# EAGLE design Dancarino (EAGLE 7.2.0)
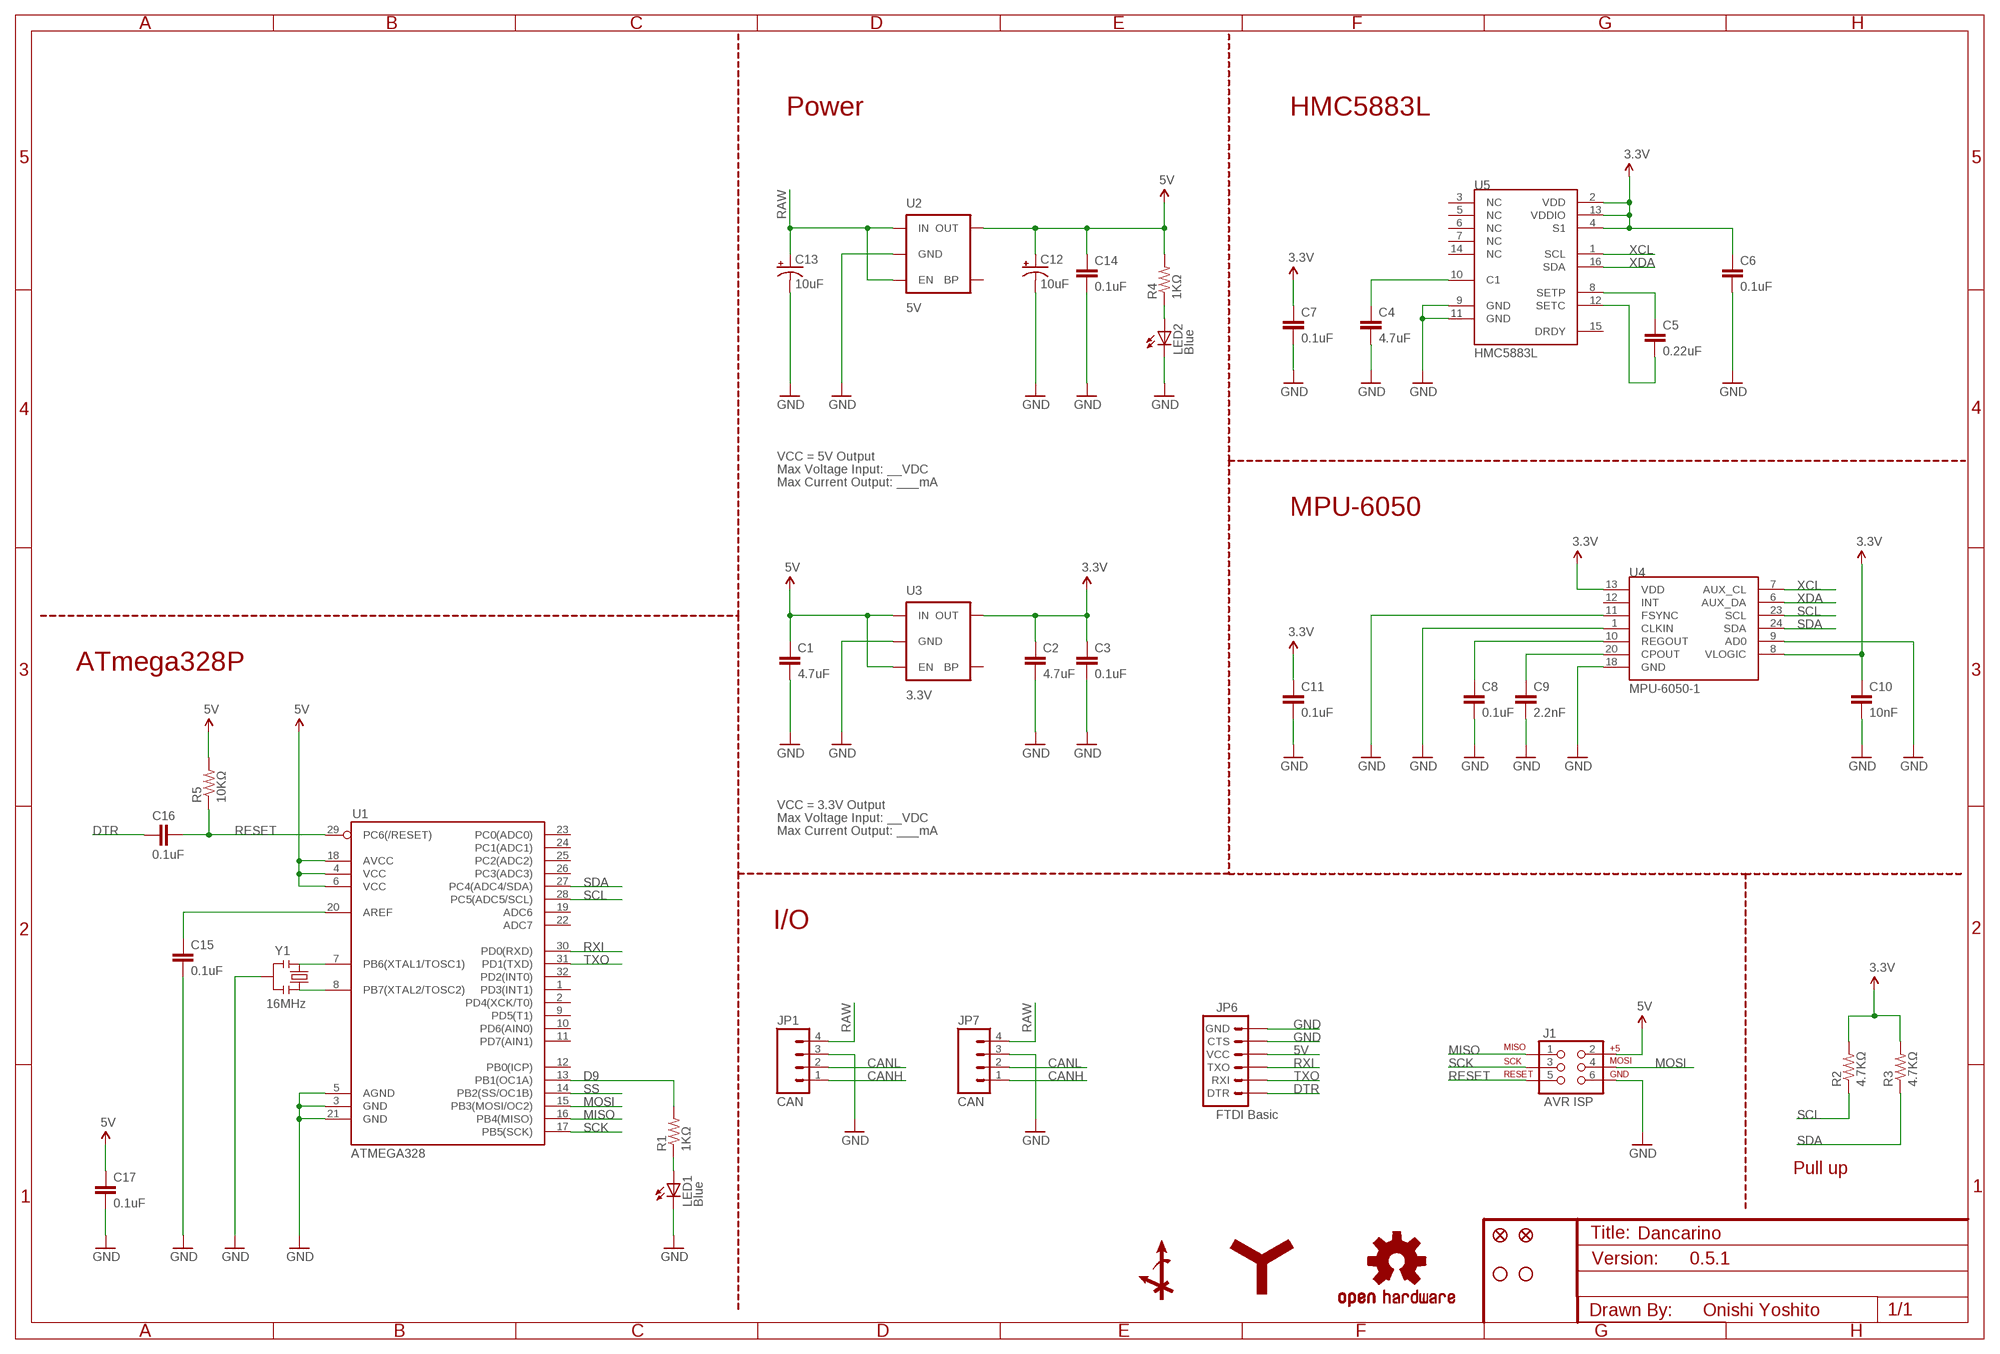
[diagram p0: schematic, sheet 1]

## Parts
C1  4.7uF  CAP0402-CAP  [0402-CAP]
C2  4.7uF  CAP0402-CAP  [0402-CAP]
C3  0.1uF  CAP0402-CAP  [0402-CAP]
C4  4.7uF  CAP0402-CAP  [0402-CAP]
C5  0.22uF  CAP0402-CAP  [0402-CAP]
C6  0.1uF  CAP0402-CAP  [0402-CAP]
C7  0.1uF  CAP0402-CAP  [0402-CAP]
C8  0.1uF  CAP0402-CAP  [0402-CAP]
C9  2.2nF  CAP0402-CAP  [0402-CAP]
C10  10nF  CAP0402-CAP  [0402-CAP]
C11  0.1uF  CAP0402-CAP  [0402-CAP]
C12  10uF  CAP_POL1206  [EIA3216]
C13  10uF  CAP_POL1206  [EIA3216]
C14  0.1uF  CAP0402-CAP  [0402-CAP]
C15  0.1uF  CAP0402-CAP  [0402-CAP]
C16  0.1uF  CAP0402-CAP  [0402-CAP]
C17  0.1uF  CAP0402-CAP  [0402-CAP]
J1  AVR ISP  AVR_SPI_PRG_6NS  [2X3-NS]
JP1  CAN  M04JST-PTH  [JST-4-PTH]
JP2  FIDUCIALUFIDUCIAL  [MICRO-FIDUCIAL]
JP3  STAND-OFFTIGHT  [STAND-OFF-TIGHT]
JP4  STAND-OFFTIGHT  [STAND-OFF-TIGHT]
JP5  FIDUCIALUFIDUCIAL  [MICRO-FIDUCIAL]
JP6  FTDI Basic  ARDUINO_SERIAL_PROGRAMPTH  [1X06]
JP7  CAN  M04JST-PTH  [JST-4-PTH]
LED1  Blue  LED0603  [LED-0603]
LED2  Blue  LED0603  [LED-0603]
R1  1KΩ  RESISTOR0402-RES  [0402-RES]
R2  4.7KΩ  RESISTOR0402-RES  [0402-RES]
R3  4.7KΩ  RESISTOR0402-RES  [0402-RES]
R4  1KΩ  RESISTOR0402-RES  [0402-RES]
R5  10KΩ  RESISTOR0402-RES  [0402-RES]
U1  ATMEGA328  ATMEGA168  [TQFP32-08]
U2  5V  V_REG_LDOSMD  [SOT23-5]
U3  3.3V  V_REG_LDOSMD  [SOT23-5]
U4  MPU-6050-1  [QFN-24-4MM2]
U5  HMC5883L  HMC5883LSMD  [16LPCC]
U$2  OSHW-LOGOS  [OSHW-LOGO-S]
U$11  AXIS-ANGLE_S  [AXIS-ANGLE_S]
U$13  YCAM_LOGO_L  [YCAM_LOGO_L]
Y1  16MHz  RESONATORSMD  [RESONATOR-SMD]

## Nets
3.3V [5V]: C2.1 C3.1 C6.1 C7.1 C10.1 C11.1 R2.2 R3.2 U3.5(OUT) U4.8(VLOGIC) U4.13(VDD) U5.2(VDD) U5.4(S1) U5.13(VDDIO)
5V [5V]: C1.1 C12.A(+) C14.1 C17.1 J1.2 JP6.4(VCC) R4.2 R5.2 U1.4(VCC) U1.6(VCC) U1.18(AVCC) U2.5(OUT) U3.1(IN) U3.3(EN)
CANH: JP1.1 JP7.1
CANL: JP1.2 JP7.2
D9: R1.2 U1.13(PB1(OC1A))
DTR: C16.1 JP6.1(DTR)
GND [GND]: C1.2 C2.2 C3.2 C4.2 C6.2 C7.2 C8.2 C9.2 C10.2 C11.2 C12.C(-) C13.C(-) C14.2 C15.2 C17.2 J1.6 JP1.3 JP6.5(CTS) JP6.6(GND) JP7.3 LED1.C LED2.C U1.3(GND) U1.5(AGND) U1.21(GND) U2.2(GND) U3.2(GND) U4.1(CLKIN) U4.9(AD0) U4.11(FSYNC) U4.18(GND) U5.9(GND) U5.11(GND) Y1.2
MISO: J1.1 U1.16(PB4(MISO))
MOSI: J1.4 U1.15(PB3(MOSI/OC2))
N$1: LED1.A R1.1
N$2: LED2.A R4.1
N$3: C4.1 U5.10(C1)
N$4: C5.1 U5.8(SETP)
N$5: C5.2 U5.12(SETC)
N$6: C9.1 U4.20(CPOUT)
N$7: C8.1 U4.10(REGOUT)
N$8: U1.7(PB6(XTAL1/TOSC1)) Y1.1
N$9: U1.8(PB7(XTAL2/TOSC2)) Y1.3
N$10: C15.1 U1.20(AREF)
RAW [RAW]: C13.A(+) JP1.4 JP7.4 U2.1(IN) U2.3(EN)
RESET: C16.2 J1.5 R5.1 U1.29(PC6(/RESET))
RXI: JP6.3(TXO) U1.30(PD0(RXD))
SCK: J1.3 U1.17(PB5(SCK))
SCL: R2.1 U1.28(PC5(ADC5/SCL)) U4.23(SCL)
SDA: R3.1 U1.27(PC4(ADC4/SDA)) U4.24(SDA)
SS: U1.14(PB2(SS/OC1B))
TXO: JP6.2(RXI) U1.31(PD1(TXD))
XCL: U4.7(AUX_CL) U5.1(SCL)
XDA: U4.6(AUX_DA) U5.16(SDA)
Unconnected: U1.1(PD3(INT1)) U1.2(PD4(XCK/T0)) U1.9(PD5(T1)) U1.10(PD6(AIN0)) U1.11(PD7(AIN1)) U1.12(PB0(ICP)) U1.19(ADC6) U1.22(ADC7) U1.23(PC0(ADC0)) U1.24(PC1(ADC1)) U1.25(PC2(ADC2)) U1.26(PC3(ADC3)) U1.32(PD2(INT0)) U2.4(BP) U3.4(BP) U4.12(INT) U5.3(NC) U5.5(NC) U5.6(NC) U5.7(NC) U5.14(NC) U5.15(DRDY)

## Notes on the sheet
- Power | HMC5883L
- VCC = 5V Output
- Max Voltage Input: __VDC
- Max Current Output: ___mA
- MPU-6050
- ATmega328P
- VCC = 3.3V Output
- Max Voltage Input: __VDC
- Max Current Output: ___mA
- I/O
- Pull up
- 0.5.1
- Onishi Yoshito

## Library data of the parts
C1-C11 C14-C17 = SparkFun-Passives:CAP: Capacitor Standard 0603 ceramic capacitor, and 0.1" leaded capacitor.
C12 C13 = SparkFun:CAP_POL: Capacitor Polarized These are standard SMD and PTH capacitors. Normally 10uF, 47uF, and 100uF in electrolytic and tantalum varieties. Always verify the external diameter of the through hole cap, it varies with capacity, voltage, and manufacturer. The EIA devices should be standard.
J1 = SparkFun-Connectors:AVR_SPI_PRG_6: AVR ISP 6 Pin This is the reduced ISP connector for AVR programming. Common on Arduino. This footprint will take up less PCB space and can be used with a 10-pin to 6-pin adapter such as SKU: BOB-08508
JP1 JP7 = SparkFun-Connectors:M04: Header 4 Standard 4-pin 0.1" header. Use with straight break away headers (SKU : PRT-00116), right angle break away headers (PRT-00553), swiss pins (PRT-00743), machine pins (PRT-00117), and female headers (PRT-00115). Molex polarized connector foot print use with SKU : PRT-08231 with associated crimp pins and housings. 1MM SMD Version SKU: PRT-10208
JP2 JP5 = SparkFun:FIDUCIAL: Fiducial Alignment Points Various fiducial points for machine vision alignment.
JP3 JP4 = SparkFun:STAND-OFF: Stand Off This is the mechanical footprint for a #4 phillips button head screw. Use the keepout ring to avoid running the screw head into surrounding components. SKU : PRT-00447
JP6 = SparkFun:ARDUINO_SERIAL_PROGRAM
LED1 LED2 = SparkFun-LED:LED: LEDs Standard schematic elements and footprints for 5mm, 3mm, 1206, and 0603 sized LEDs. 5mm - Spark Fun Electronics SKU : COM-00529 (and others)
R1-R5 = SparkFun-Passives:RESISTOR: Resistor Basic schematic elements and footprints for 0603, 1206, and PTH resistors.
U1 = SparkFun:ATMEGA168
U2 U3 = SparkFun:V_REG_LDO: Voltage Regulator LDO Standard 150mA LDO voltage regulator in SOT-23 layout. Micrel part MIC5205. BP (by-pass) pin is used to lower output noise with 470pF cap.
U4 = Testing:MPU-6050
U5 = SparkFun-Sensors:HMC5883L: 3 Axis Digital Compass IC; PROD_ID: IC-10284
U$2 = SparkFun-Aesthetics:OSHW-LOGO: Open Source Hardware Logo This logo indicates the piece of hardware it is found on incorporates a OSHW license and/or adheres to the definition of open source hardware found here: http://freedomdefined.org/OSHW
U$11 = ram:AXIS-ANGLE_S
U$13 = ram:YCAM_LOGO_L
Y1 = SparkFun-FreqCtrl:RESONATOR: Resonator Small SMD resonator. This is the itty bitty 10/20MHz resonators with built in caps. CSTCE10M0G55 and CSTCE20M0V53. Footprint has been reviewed closely but hasn't been tested yet.

## Board
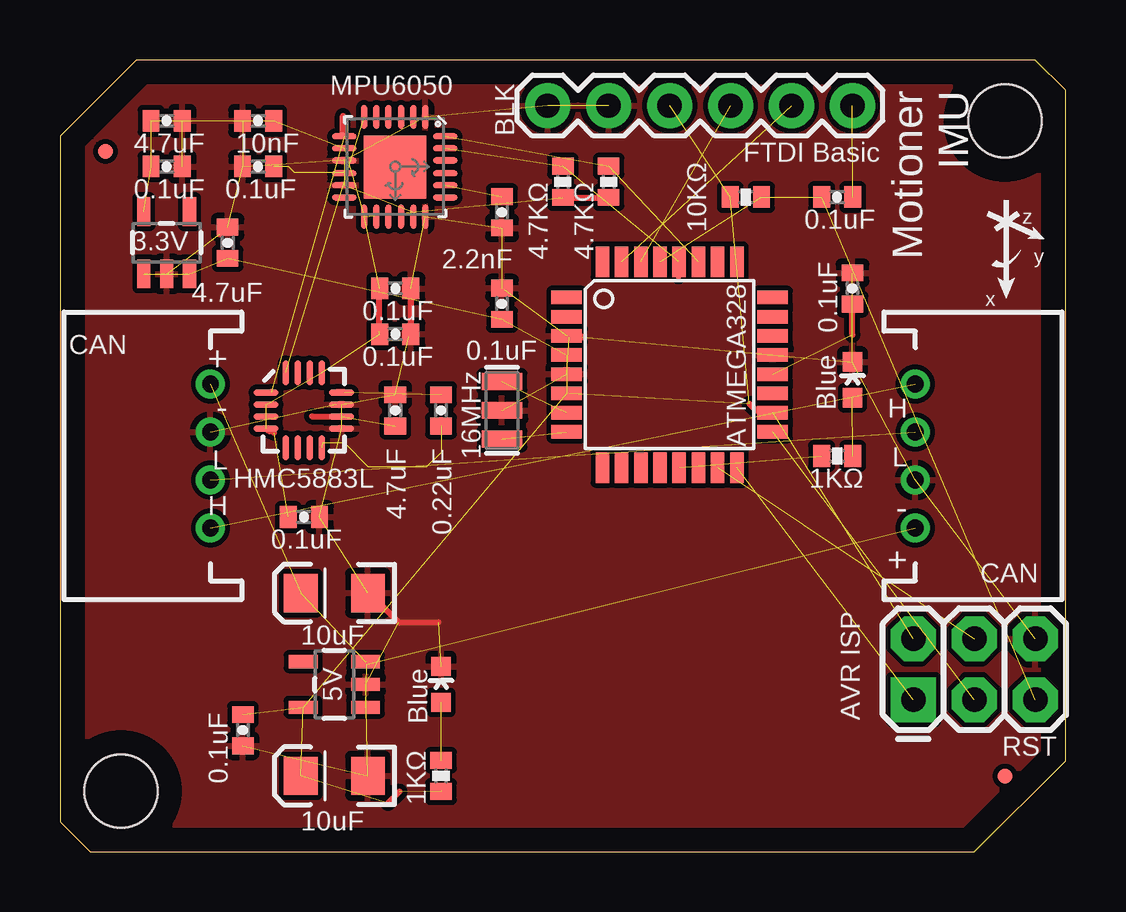
[diagram p1: board, top side]
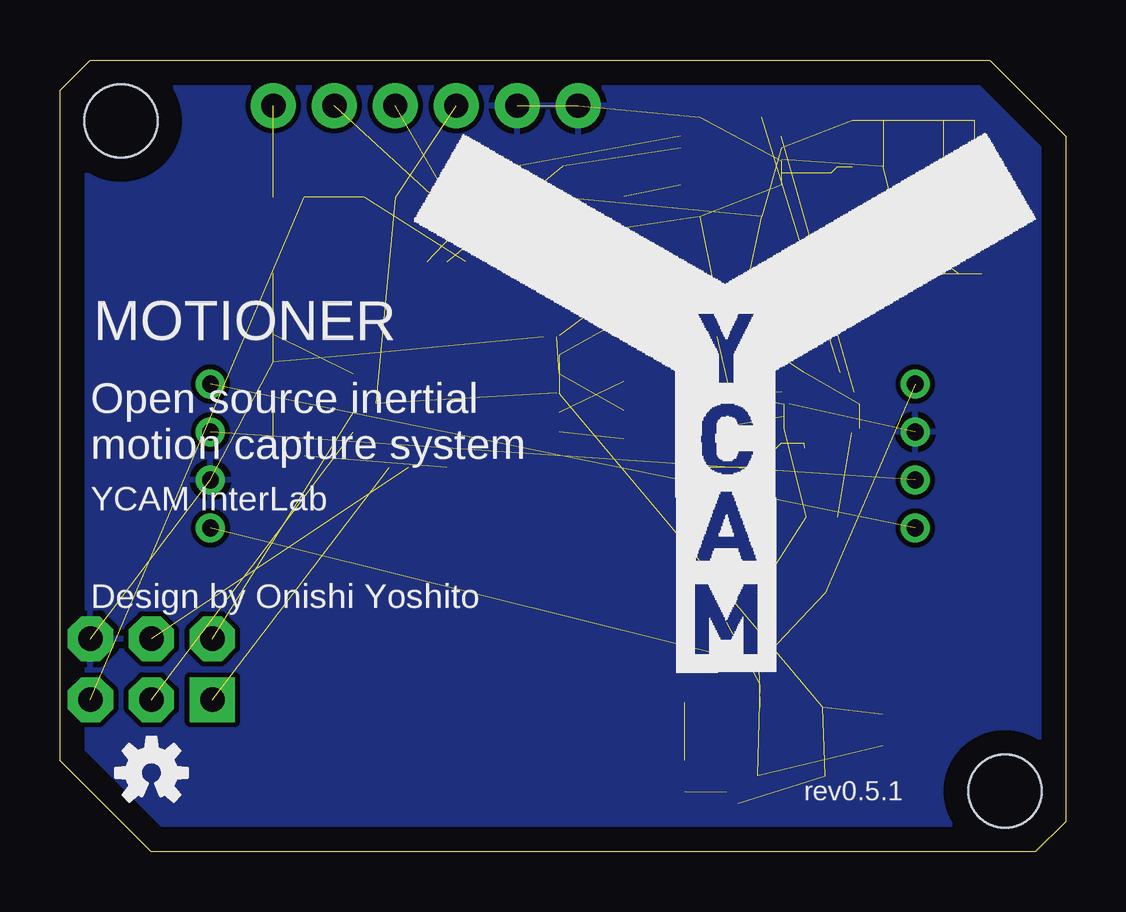
[diagram p2: board, bottom side, seen from below]

Size 41.91 x 33.02 mm. Coordinates in mm from the lower left corner, seen from the top.
Outline: 41.91,3.81 41.91,31.75 40.64,33.02 3.17,33.02 0,29.84 0,1.27 1.27,0 38.1,0 41.91,3.81
Copper layers (1*16): Top 0.035mm / dielectric 1.5mm / Bottom 0.035mm
Design rules "default": minimum track width 10mil, minimum drill 24mil, track to track 8mil, track to pad 8mil, pad to pad 8mil, via to via 8mil, smd to smd 8mil, copper to edge 40mil, drill to drill 8mil, minimum pad ring 10mil, minimum via ring 8mil, stop-mask expansion 4mil, vias tented up to drill 0mil, thermal gap 10mil

### Footprints (pad centres in the part's own frame; a part is rotated, then mirrored left to right if it is on the bottom)
0402-CAP = smd 0.7 x 0.9: 1 -0.65,0; 2 0.65,0
EIA3216 = smd 1.4 x 1.6: A 1.4,0; C -1.4,0
2X3-NS = drill 1.016 pad 1.88 square: 1 -2.54,-1.27 | drill 1.016 pad 1.88 octagon: 2 -2.54,1.27; 3 0,-1.27; 4 0,1.27; 5 2.54,-1.27; 6 2.54,1.27
JST-4-PTH = drill 0.7: 1 -3,-5; 2 -1,-5; 3 1,-5; 4 3,-5
MICRO-FIDUCIAL = smd 0.635 x 0.635: 1 0,0
STAND-OFF-TIGHT = hole 3.048: 0,0
1X06 = drill 1.016 pad 1.88: 1 0,0; 2 2.54,0; 3 5.08,0; 4 7.62,0; 5 10.16,0; 6 12.7,0
LED-0603 = smd 0.8 x 0.8: A 0,-0.75; C 0,0.75
0402-RES = smd 0.7 x 0.9: 1 -0.65,0; 2 0.65,0
TQFP32-08 = smd 1.27 x 0.559: 1 -4.293,2.8; 2 -4.293,2; 3 -4.293,1.2; 4 -4.293,0.4; 5 -4.293,-0.4; 6 -4.293,-1.2; 7 -4.293,-2; 8 -4.293,-2.8; 17 4.293,-2.8; 18 4.293,-2; 19 4.293,-1.2; 20 4.293,-0.4; 21 4.293,0.4; 22 4.293,1.2; 23 4.293,2; 24 4.293,2.8 | smd 0.559 x 1.27: 9 -2.8,-4.293; 10 -2,-4.293; 11 -1.2,-4.293; 12 -0.4,-4.293; 13 0.4,-4.293; 14 1.2,-4.293; 15 2,-4.293; 16 2.8,-4.293; 25 2.8,4.293; 26 2,4.293; 27 1.2,4.293; 28 0.4,4.293; 29 -0.4,4.293; 30 -1.2,4.293; 31 -2,4.293; 32 -2.8,4.293
SOT23-5 = smd 0.55 x 1.2: 1 -0.95,-1.3; 2 0,-1.3; 3 0.95,-1.3; 4 0.95,1.3; 5 -0.95,1.3
QFN-24-4MM2 = smd 1.016 x 0.254: 1 -2.066,1.257; 2 -2.066,0.75; 3 -2.066,0.247; 4 -2.066,-0.287; 5 -2.066,-0.792; 6 -2.066,-1.297; 13 2.086,-1.297; 14 2.086,-0.792; 15 2.086,-0.287; 16 2.086,0.247; 17 2.086,0.75; 18 2.086,1.257 | smd 0.254 x 1.016: 7 -1.267,-2.122; 8 -0.762,-2.122; 9 -0.258,-2.122; 10 0.278,-2.122; 11 0.78,-2.122; 12 1.287,-2.122; 19 1.287,2.082; 20 0.78,2.082; 21 0.278,2.082; 22 -0.258,2.082; 23 -0.762,2.082; 24 -1.267,2.082 | smd 2.616 x 2.616: P$1 0.02,-0.01
16LPCC = smd 1.05 x 0.28: 1 -1.57,0.75; 2 -1.57,0.25; 3 -1.57,-0.25; 4 -1.57,-0.75; 9 1.57,-0.75; 10 1.57,-0.25; 11 1.57,0.25; 12 1.57,0.75 | smd 0.28 x 1.05: 5 -0.75,-1.57; 6 -0.25,-1.57; 7 0.25,-1.57; 8 0.75,-1.57; 13 0.75,1.57; 14 0.25,1.57; 15 -0.25,1.57; 16 -0.75,1.57
RESONATOR-SMD = smd 0.7 x 1.7: 1 -1.2,0; 2 0,0; 3 1.2,0

### Placement (x,y rotation side)
C1  6.99,25.4 90 top
C2  4.45,30.48 0 top
C3  4.45,28.57 0 top
C4  13.97,18.41 90 top
C5  15.88,18.41 90 top
C6  13.97,21.59 0 top
C7  10.16,13.97 0 top
C8  8.26,28.57 180 top
C9  18.41,26.67 270 top
C10  8.26,30.48 180 top
C11  13.97,23.5 0 top
C12  11.43,3.17 180 top
C13  11.43,10.79 180 top
C14  7.62,5.08 270 top
C15  33.02,23.5 90 top
C16  32.38,27.3 180 top
C17  18.41,22.86 90 top
J1  38.1,7.62 0 top
JP1  40.64,16.51 270 top
JP2  1.91,29.21 180 top
JP3  39.37,30.48 180 top
JP4  2.54,2.54 180 top
JP5  39.37,3.17 180 top
JP6  33.02,31.11 180 top
JP7  1.27,16.51 90 top
LED1  33.02,19.68 0 top
LED2  15.88,6.99 0 top
R1  32.38,16.51 180 top
R2  20.95,27.94 270 top
R3  22.86,27.94 270 top
R4  15.88,3.17 270 top
R5  28.57,27.3 180 top
U1  25.4,20.32 0 top
U2  11.43,6.99 90 top
U3  4.45,25.4 0 top
U4  13.97,28.57 270 top
U5  10.16,18.41 0 top
U$2  38.1,3.3 0 bottom
U$11  41.02,27.18 180 top
U$13  27.18,5.71 0 bottom
Y1  18.41,18.41 270 top

### Tracks (layer width: path | path; a pad name or v marks a point on that pad's centre or on a via)
3.3V  (12 unrouted)
  Top 0.254: 3.79,30.48 C2.1 | R3.2 R2.2 | 13.31,21.69 C11.1 | U5.2 | 8.92,17.47 8.84,17.55 8.7,17.55 U5.4
5V  (14 unrouted)
  Top 0.254: 13.66,2.03 14.15,2.52 | U1.6 21.21,19.13 | 28.73,18.69 29.03,18.39 29.59,18.39 U1.18
CANH  (1 unrouted)
CANL  (1 unrouted)
D9  (1 unrouted)
  Top 0.254: U1.13
DTR  (1 unrouted)
GND  (32 unrouted)
  Top 0.254: 11.53,18.67 U5.11 | C6.2 14.61,21.59 14.61,23.39 C11.2 | 21.11,21.54 U1.3 21.21,21.46 21.77,21.46 | 18.52,23.44 C17.2 | 21.11,19.94 U1.5 | 14.53,21.49 C6.2 | 18.31,18.49 Y1.2 | 14.73,21.54 C6.2 | 6.25,17.53 JP7.3 | 11.84,28.85 U4.9 | 11.84,27.79 U4.11 | 6.66,25.76 6.88,25.98 C1.2 | C13.C 12.95,10.74 14.12,9.58 15.77,9.58
  pour Bottom: 41.91,3.81 41.91,31.75 40.64,33.02 3.17,33.02 0,29.84 0,1.27 1.27,0 38.1,0
  pour Top: 41.91,3.81 41.91,31.75 40.64,33.02 3.17,33.02 0,29.84 0,1.27 1.27,0 38.1,0
MISO  (1 unrouted)
MOSI  (1 unrouted)
N$1  (1 unrouted)
N$2  (1 unrouted)
N$3  (1 unrouted)
  Top 0.254: 10.49,18.16 11.51,18.16 U5.10
N$4  (6 unrouted)
N$5  (1 unrouted)
  Top 0.254: 11.84,19.18 11.53,19.18 U5.12
N$6  (1 unrouted)
N$7  (3 unrouted)
  Top 0.254: 11.84,28.32 U4.10
N$8  (1 unrouted)
  Top 0.254: Y1.1
N$9  (1 unrouted)
N$10  (1 unrouted)
  Top 0.254: 33.02,21.57 C15.1
RAW  (4 unrouted)
  Top 0.254: 12.78,7.82 U2.3
RESET  (3 unrouted)
RXI  (1 unrouted)
SCK  (1 unrouted)
SCL  (2 unrouted)
  Top 0.254: 25.78,24 25.78,24.61 U1.28
SDA  (2 unrouted)
TXO  (1 unrouted)
XCL  (1 unrouted)
  Top 0.254: 11.79,30.68 11.79,29.92 11.86,29.84 U4.7 | 8.81,19.18 U5.1
XDA  (1 unrouted)

### Text on the board
tPlace: Motioner / IMU | z | y | x
bPlace: MOTIONER | Open source inertial / motion capture system | YCAM InterLab | Design by Onishi Yoshito | rev0.5.1
tNames: MPU6050 | BLK | + | - | H | L | L | H | - | + | RST